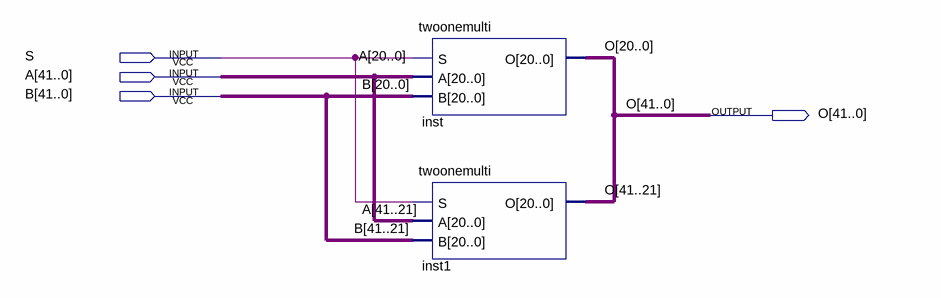
[diagram p0: schematic sheet]
// Quartus schematic fouronemulti.bdf as structural Verilog: 2 symbols, 4 pins
module fouronemulti (
  input  S,
  input  [41:0] A,
  input  [41:0] B,
  output [41:0] O
);

  twoonemulti inst (.S(S), .A(A[20:0]), .B(B[20:0]), .O(O[20:0]));
  twoonemulti inst1 (.S(S), .A(A[41:21]), .B(B[41:21]), .O(O[41:21]));
endmodule
